# EAGLE schematic ControlBoard (EAGLE 8.3.1)
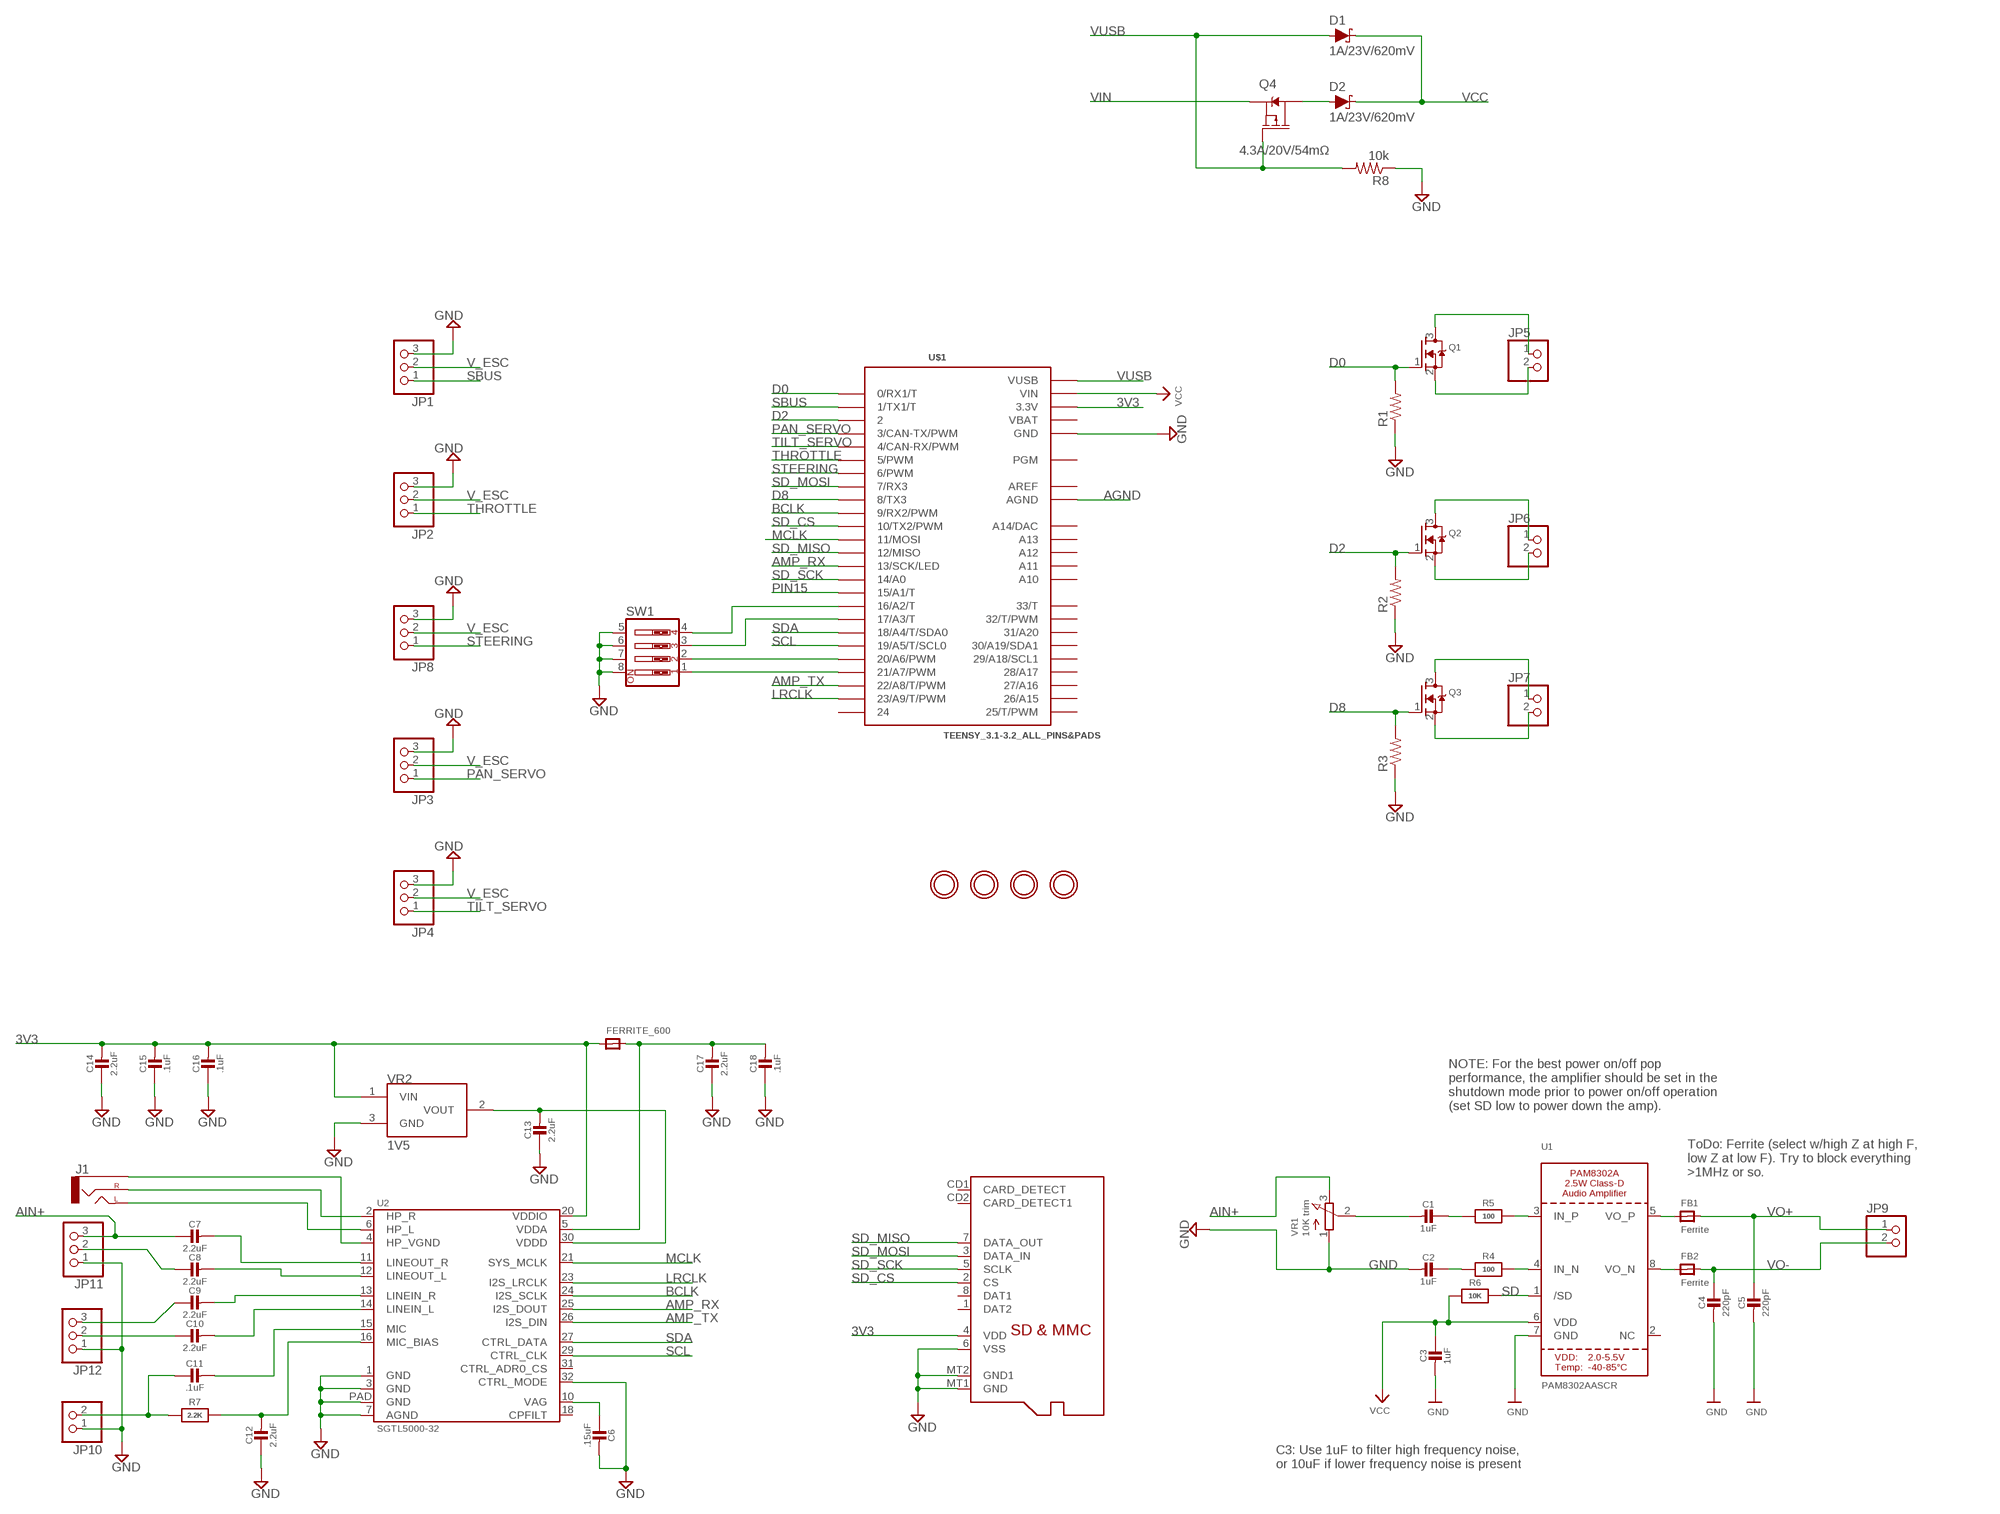
[diagram p0: schematic, sheet 1]

## Parts
C1  1uF  CAP_CERAMIC0805-NOOUTLINE  [0805-NO]
C2  1uF  CAP_CERAMIC0805-NOOUTLINE  [0805-NO]
C3  1uF  CAP_CERAMIC0805-NOOUTLINE  [0805-NO]
C4  220pF  CAP_CERAMIC0805-NOOUTLINE  [0805-NO]
C5  220pF  CAP_CERAMIC0805-NOOUTLINE  [0805-NO]
C6  .15uF  CAP_CERAMIC0805-NOOUTLINE  [0805-NO]
C7  2.2uF  CAP_CERAMIC0805-NOOUTLINE  [0805-NO]
C8  2.2uF  CAP_CERAMIC0805-NOOUTLINE  [0805-NO]
C9  2.2uF  CAP_CERAMIC0805-NOOUTLINE  [0805-NO]
C10  2.2uF  CAP_CERAMIC0805-NOOUTLINE  [0805-NO]
C11  .1uF  CAP_CERAMIC0805-NOOUTLINE  [0805-NO]
C12  2.2uF  CAP_CERAMIC0805-NOOUTLINE  [0805-NO]
C13  2.2uF  CAP_CERAMIC0805-NOOUTLINE  [0805-NO]
C14  2.2uF  CAP_CERAMIC0805-NOOUTLINE  [0805-NO]
C15  .1uF  CAP_CERAMIC0805-NOOUTLINE  [0805-NO]
C16  .1uF  CAP_CERAMIC0805-NOOUTLINE  [0805-NO]
C17  2.2uF  CAP_CERAMIC0805-NOOUTLINE  [0805-NO]
C18  .1uF  CAP_CERAMIC0805-NOOUTLINE  [0805-NO]
D1  1A/23V/620mV  DIODE-SCHOTTKY-BAT20J  [SOD-323]
D2  1A/23V/620mV  DIODE-SCHOTTKY-BAT20J  [SOD-323]
FB1  Ferrite  FERRITE_0805  [_0805]
FB2  Ferrite  FERRITE_0805  [_0805]
FERRITE_600  FERRITE0805  [0805]
J1  AUDIO_JACK_2.5MM_2.5MM_SMD  [STEREOJACK2.5MM]
JP1  PINHD-1X3/90  [1X03/90]
JP2  PINHD-1X3/90  [1X03/90]
JP3  PINHD-1X3/90  [1X03/90]
JP4  PINHD-1X3/90  [1X03/90]
JP5  PINHD-1X2  [1X02]
JP6  PINHD-1X2  [1X02]
JP7  PINHD-1X2  [1X02]
JP8  PINHD-1X3/90  [1X03/90]
JP9  PINHD-1X2  [1X02]
JP10  PINHD-1X2  [1X02]
JP11  PINHD-1X3/90  [1X03/90]
JP12  PINHD-1X3/90  [1X03/90]
Q1  MOSFET-NREFLOW  [SOT23]
Q2  MOSFET-NREFLOW  [SOT23]
Q3  MOSFET-NREFLOW  [SOT23]
Q4  4.3A/20V/54mΩ  MOSFET_PCH-IRLML2244  [SOT23-3]
R1  R-US_0207/7  [0207/7]
R2  R-US_0207/7  [0207/7]
R3  R-US_0207/7  [0207/7]
R4  100  RESISTOR0805_NOOUTLINE  [0805-NO]
R5  100  RESISTOR0805_NOOUTLINE  [0805-NO]
R6  10K  RESISTOR0805_NOOUTLINE  [0805-NO]
R7  2.2K  RESISTOR0805_NOOUTLINE  [0805-NO]
R8  10k  R-US_0207/7  [0207/7]
SW1  SW_DIP-4  [EDG-04]
U1  PAM8302AASCR  AUDIOAMP_PAM8302A  [MSOP8_0.65MM]
U2  SGTL5000-32  [QFN-32-5MM]
U$1  TEENSY_3.1-3.2_ALL_PINS&PADS  [TEENSY_3.0-3.2_ALL_PINS_&_PADS]
U$4  MOUNTINGHOLE2.0  [MOUNTINGHOLE_2.0_PLATED]
U$5  MOUNTINGHOLE2.0  [MOUNTINGHOLE_2.0_PLATED]
U$6  MICROSD  [MICROSD]
U$10  MOUNTINGHOLE2.0  [MOUNTINGHOLE_2.0_PLATED]
U$11  MOUNTINGHOLE2.0  [MOUNTINGHOLE_2.0_PLATED]
VR1  10K trim  TRIMPOT3303W/X  [TRIMPOT_BOURNS_3303W]
VR2  1V5  AP7313SOT  [SOT23]

## Nets
3V3: C14.2 C15.2 C16.2 FERRITE_600.1 U2.20(VDDIO) U$1.3.3V U$1.3.3V1(3.3V) U$1.3.3V2(3.3V) U$6.4(VDD) VR2.1(VIN)
AGND: U$1.AGND
AIN+: C7.1 JP11.3 VR1.3(E)
AMP_RX: U2.25(I2S_DOUT) U$1.13(13/SCK/LED)
AMP_TX: U2.26(I2S_DIN) U$1.22/A8(22/A8/T/PWM)
BCLK: U2.24(I2S_SCLK) U$1.9(9/RX2/PWM)
D0: Q1.1(G) R1.2 U$1.0(0/RX1/T)
D2: Q2.1(G) R2.2 U$1.2
D8: Q3.1(G) R3.2 U$1.8(8/TX3)
GND: C2.2 C3.2 C4.2 C5.2 C6.2 C12.1 C13.1 C14.1 C15.1 C16.1 C17.1 C18.1 JP1.3 JP2.3 JP3.3 JP4.3 JP8.3 JP10.1 JP11.1 JP12.1 R1.1 R2.1 R3.1 R8.1 SW1.5 SW1.6 SW1.7 SW1.8 U1.7(GND) U2.1(GND) U2.3(GND) U2.7(AGND) U2.32(CTRL_MODE) U2.PAD(GND) U$1.GND U$1.GND1(GND) U$1.GND2(GND) U$6.6(VSS) U$6.MT1(GND) U$6.MT2(GND1) VR1.1(A) VR2.3(GND)
LRCLK: U2.23(I2S_LRCLK) U$1.23/A9(23/A9/T/PWM)
MCLK: U2.21(SYS_MCLK) U$1.11(11/MOSI)
N$1: R4.2 U1.4(IN_N)
N$2: SW1.1 U$1.21/A7(21/A7/PWM)
N$3: SW1.2 U$1.20/A6(20/A6/PWM)
N$4: SW1.3 U$1.17/A3(17/A3/T)
N$5: SW1.4 U$1.16/A2(16/A2/T)
N$6: R5.2 U1.3(IN_P)
N$7: C2.1 R4.1
N$8: FB2.1 U1.8(VO_N)
N$9: JP6.1 Q2.3(D)
N$10: JP6.2 Q2.2(S)
N$11: JP7.1 Q3.3(D)
N$12: JP7.2 Q3.2(S)
N$13: JP5.2 Q1.2(S)
N$14: JP5.1 Q1.3(D)
N$15: FB1.1 U1.5(VO_P)
N$16: C1.1 R5.1
N$17: C1.2 VR1.2(S)
N$18: C6.1 U2.10(VAG)
N$19: J1.1(LEFT) U2.6(HP_L)
N$20: J1.4(RIGHT) U2.2(HP_R)
N$21: J1.5(SLEEVE) U2.4(HP_VGND)
N$22: C8.2 U2.12(LINEOUT_L)
N$23: C7.2 U2.11(LINEOUT_R)
N$24: C9.2 U2.13(LINEIN_R)
N$25: C10.2 U2.14(LINEIN_L)
N$26: C11.2 U2.15(MIC)
N$27: C12.2 R7.2 U2.16(MIC_BIAS)
N$28: C11.1 JP10.2 R7.1
N$29: C17.2 C18.2 FERRITE_600.2 U2.5(VDDA)
N$30: C13.2 U2.30(VDDD) VR2.2(VOUT)
N$31: D2.A Q4.3(D)
N$33: C8.1 JP11.2
N$35: C9.1 JP12.3
N$36: C10.1 JP12.2
PAN_SERVO: JP3.1 U$1.3(3/CAN-TX/PWM)
PIN15: U$1.15/A1(15/A1/T)
SBUS: JP1.1 U$1.1(1/TX1/T)
SCL: U2.29(CTRL_CLK) U$1.19/A5(19/A5/T/SCL0)
SD: R6.2 U1.1(/SD)
SD_CS: U$1.10(10/TX2/PWM) U$6.2(CS)
SD_MISO: U$1.12(12/MISO) U$6.7(DATA_OUT)
SD_MOSI: U$1.7(7/RX3) U$6.3(DATA_IN)
SD_SCK: U$1.14/A0 U$6.5(SCLK)
SDA: U2.27(CTRL_DATA) U$1.18/A4(18/A4/T/SDA0)
STEERING: JP8.1 U$1.6(6/PWM)
THROTTLE: JP2.1 U$1.5(5/PWM)
TILT_SERVO: JP4.1 U$1.4(4/CAN-RX/PWM)
V_ESC: JP1.2 JP2.2 JP3.2 JP4.2 JP8.2
VCC: C3.1 D1.C D2.C R6.1 U1.6(VDD) U$1.VIN
VIN: Q4.2(S)
VO+: C5.1 FB1.2 JP9.1
VO-: C4.1 FB2.2 JP9.2
VUSB: D1.A Q4.1(G) R8.2 U$1.VUSB
Unconnected: U1.2(NC) U2.18(CPFILT) U2.31(CTRL_ADR0_CS) U$1.24 U$1.25(25/T/PWM) U$1.26(26/A15) U$1.27(27/A16) U$1.28(28/A17) U$1.29(29/A18/SCL1) U$1.30(30/A19/SDA1) U$1.31(31/A20) U$1.32(32/T/PWM) U$1.33(33/T) U$1.A10 U$1.A11 U$1.A12 U$1.A13 U$1.PGM U$1.RESET/DAC(A14/DAC) U$6.1(DAT2) U$6.8(DAT1) U$6.CD1(CARD_DETECT) U$6.CD2(CARD_DETECT1)

## Notes on the sheet
- NOTE: For the best power on/off pop
  performance, the amplifier should be set in the
  shutdown mode prior to power on/off operation
  (set SD low to power down the amp).
- ToDo: Ferrite (select w/high Z at high F,
  low Z at low F). Try to block everything
  >1MHz or so.
- C3: Use 1uF to filter high frequency noise,
  or 10uF if lower frequency noise is present

## Power pins joined to a net without a drawn wire
AREF: U$1.AREF
VBAT: U$1.VBAT

## Library data of the parts
C1-C12 = microbuilder:CAP_CERAMIC: Ceramic Capacitors For new designs, use the packages preceded by an '_' character since they are more reliable: The following footprints should be used on most boards: _0402 - Standard footprint for regular board layouts _0603 - Standard footprint for regular board layouts _0805 - Standard footprint for regular board layouts _1206 - Standard footprint for regular board layouts For extremely tight-pitch boards where space is at a premium, the following 'micro-pitch' footprints can be used (smaller pads, no silkscreen outline, etc.): _0402MP - Micro-pitch footprint for very dense/compact boards _0603MP - Micro-pitch footprint for very dense/compact boards _0805MP - Micro-pitch footprint for very dense/compact boards _1206MP - Micro-pitch footprint for very dense/compact boards
C13-C18 = ControlBoard:CAP_CERAMIC: Ceramic Capacitors For new designs, use the packages preceded by an '_' character since they are more reliable: The following footprints should be used on most boards: _0402 - Standard footprint for regular board layouts _0603 - Standard footprint for regular board layouts _0805 - Standard footprint for regular board layouts _1206 - Standard footprint for regular board layouts For extremely tight-pitch boards where space is at a premium, the following 'micro-pitch' footprints can be used (smaller pads, no silkscreen outline, etc.): _0402MP - Micro-pitch footprint for very dense/compact boards _0603MP - Micro-pitch footprint for very dense/compact boards _0805MP - Micro-pitch footprint for very dense/compact boards _1206MP - Micro-pitch footprint for very dense/compact boards
D1 D2 = SparkFun-DiscreteSemi:DIODE-SCHOTTKY: Schottky diode A Schottky diode is a semiconductor diode which has a low forward voltage drop and a very fast switching action.; PROD_ID: DIO-11623
FB1 FB2 = microbuilder:FERRITE: Ferrite Bead 0603 MMZ1608B121C - 120 Ohm @ 100MHz, 600mA, 0.15 Ohm DC Resistance - Digikey: 445-2164-1-ND BK1608HW121-T - 120 Ohm, 600mA Ferrite Chip - Digikey: 587-1876-2-ND 0805 HZ0805B272R-10 - 2.7K Ohm @ 100MHz, 200mA, 0.8 Ohm DC Resistance - Digikey: 240-2504-1-ND (see also Murata BLM21BD272SN1L) MMZ2012Y152B - 1.5K Ohm @ 100MHz, 500mA, 0.4 Ohm DC Resistance - Digikey: 445-1560-1-ND - Mainly for high frequency (80-400MHz) MMZ2012R102A - 1K Ohm @ 100MHz, 500mA, 0.3 Ohm DC Resistance - Digikey: 445-1555-2-ND - More general purpose (10-200MHz)
FERRITE_600 = ControlBoard:FERRITE: Ferrite Bead 0603 MMZ1608B121C - 120 Ohm @ 100MHz, 600mA, 0.15 Ohm DC Resistance - Digikey: 445-2164-1-ND BK1608HW121-T - 120 Ohm, 600mA Ferrite Chip - Digikey: 587-1876-2-ND 0805 HZ0805B272R-10 - 2.7K Ohm @ 100MHz, 200mA, 0.8 Ohm DC Resistance - Digikey: 240-2504-1-ND (see also Murata BLM21BD272SN1L) MMZ2012Y152B - 1.5K Ohm @ 100MHz, 500mA, 0.4 Ohm DC Resistance - Digikey: 445-1560-1-ND - Mainly for high frequency (80-400MHz) MMZ2012R102A - 1K Ohm @ 100MHz, 500mA, 0.3 Ohm DC Resistance - Digikey: 445-1555-2-ND - More general purpose (10-200MHz)
J1 = SparkFun-Connectors:AUDIO_JACK_2.5MM: Audio Jack 2.5mm variants of PTH and SMT audio jacks. SparkFun Products: SparkFun PicoBoard <https://www.sparkfun.com/products/11888>- 2.5mm SMD; PROD_ID: CONN-10062
JP1-JP4 JP8 JP11 JP12 = pinhead:PINHD-1X3: PIN HEADER
JP5-JP7 JP9 JP10 = pinhead:PINHD-1X2: PIN HEADER
Q1-Q3 = adafruit:MOSFET-N: N-Channel Mosfet 2N7002E - 60V 260mA SOT23 [Digikey: 2N7002ET1GOSTR-ND] - REEL BSH103 - 30V 850mA SOT23 [Digikey: 568-5013-1-ND]
Q4 = SparkFun-DiscreteSemi:MOSFET_PCH: P-channel MOSFETs Voltage controlled devices that allow control of high current outputs. SparkFun Products: SparkFun ESP32 Thing <https://www.sparkfun.com/products/13907> SparkFun ESP8266 Thing <https://www.sparkfun.com/products/13231>; PROD_ID: TRANS-11153
R1-R3 R8 = resistor:R-US_: RESISTOR, American symbol
R4-R7 = microbuilder:RESISTOR: Resistors For new designs, use the packages preceded by an '_' character since they are more reliable: The following footprints should be used on most boards: _0402 - Standard footprint for regular board layouts _0603 - Standard footprint for regular board layouts _0805 - Standard footprint for regular board layouts _1206 - Standard footprint for regular board layouts For extremely tight-pitch boards where space is at a premium, the following 'micro-pitch' footprints can be used (smaller pads, no silkscreen outline, etc.): _0402MP - Micro-pitch footprint for very dense/compact boards _0603MP - Micro-pitch footprint for very dense/compact boards _0805MP - Micro-pitch footprint for very dense/compact boards _1206MP - Micro-pitch footprint for very dense/compact boards
SW1 = special:SW_DIP-4: DIP SWITCH
U1 = microbuilder:AUDIOAMP_PAM8302A: PAM8302A - 2.5W Class-D Mono Audio Amplifier MSOP8 = PAM8302AASCR
U2 = ControlBoard:SGTL5000-32
U$1 = Teensy_3_and_LC_Series_Boards_v1.4:TEENSY_3.1-3.2_ALL_PINS&PADS: Footprint for Teensy 3.1 or 3.2 board using all pads and all through-holes. Pads need a 2x7 0.1" SMD header.
U$4 U$5 U$10 U$11 = microbuilder:MOUNTINGHOLE: Mounting Hole For #2 screws (0.086"/2.18mm width, 0.094"/2.4mm hole) use 2.5mm; BOM: EXCLUDE
U$6 = adafruit:MICROSD: Micro-SD / Transflash card holder with SPI pinout For the 3M # 2908-05WB-MG and/or 4UCON #19656 push-push type
VR1 = microbuilder:TRIMPOT: 3-Pin SMT Trimpots Bourns TC33 (X-2) Series 1K - Digikey: TC33X-102ECT-ND 10K - Digikey: TC33X-2-103E 100K - Digikey: TC33X-104ECT-ND Bourns 3303 (W) Series 3mm 10K Single Turn - Digikey: 3303W-103ETR-ND 3mm 100K Single Turn - Digikey: 3303X-104ETR-ND
VR2 = ControlBoard:AP7313: Diodes Incorporated Low Dropout Linear Regulator 150mA at 1.0V to 3.3V, 2V to 6V input 150mV dropout at 150mA operation TEMPERATURE: -40C to 85C Datasheet Link <https://www.diodes.com/assets/Datasheets/AP7313.pdf>